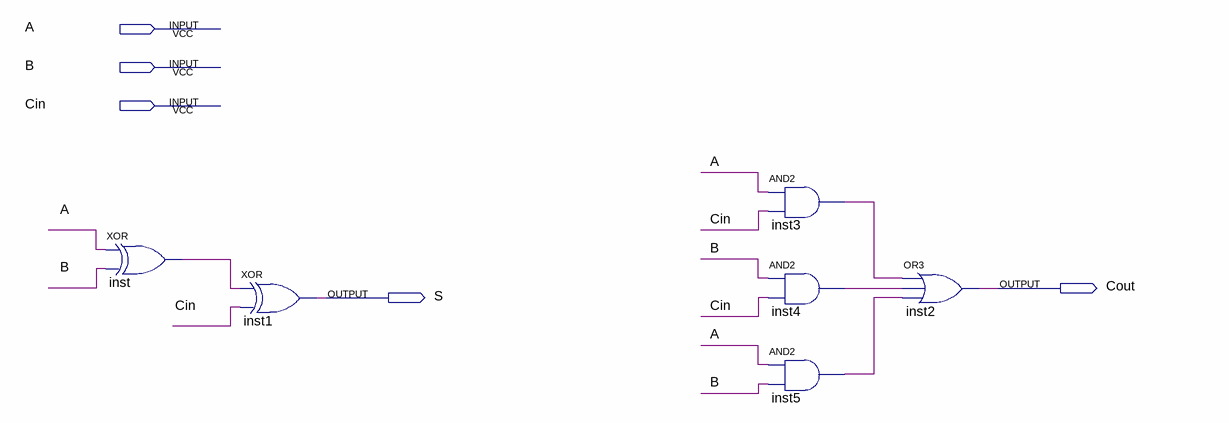
[diagram p0: schematic sheet]
// Quartus schematic somador_completo.bdf as structural Verilog: 6 symbols, 5 pins
module somador_completo (
  input  A,
  input  B,
  input  Cin,
  output Cout,
  output S
);

  wire inst3_out, inst4_out, inst5_out, inst_out;

  xor inst (inst_out, A, B);
  xor inst1 (S, inst_out, Cin);
  and inst3 (inst3_out, A, Cin);
  and inst4 (inst4_out, B, Cin);
  and inst5 (inst5_out, A, B);
  or inst2 (Cout, inst3_out, inst4_out, inst5_out);
endmodule
